# EAGLE design RH023.2 (EAGLE 7.1.0)
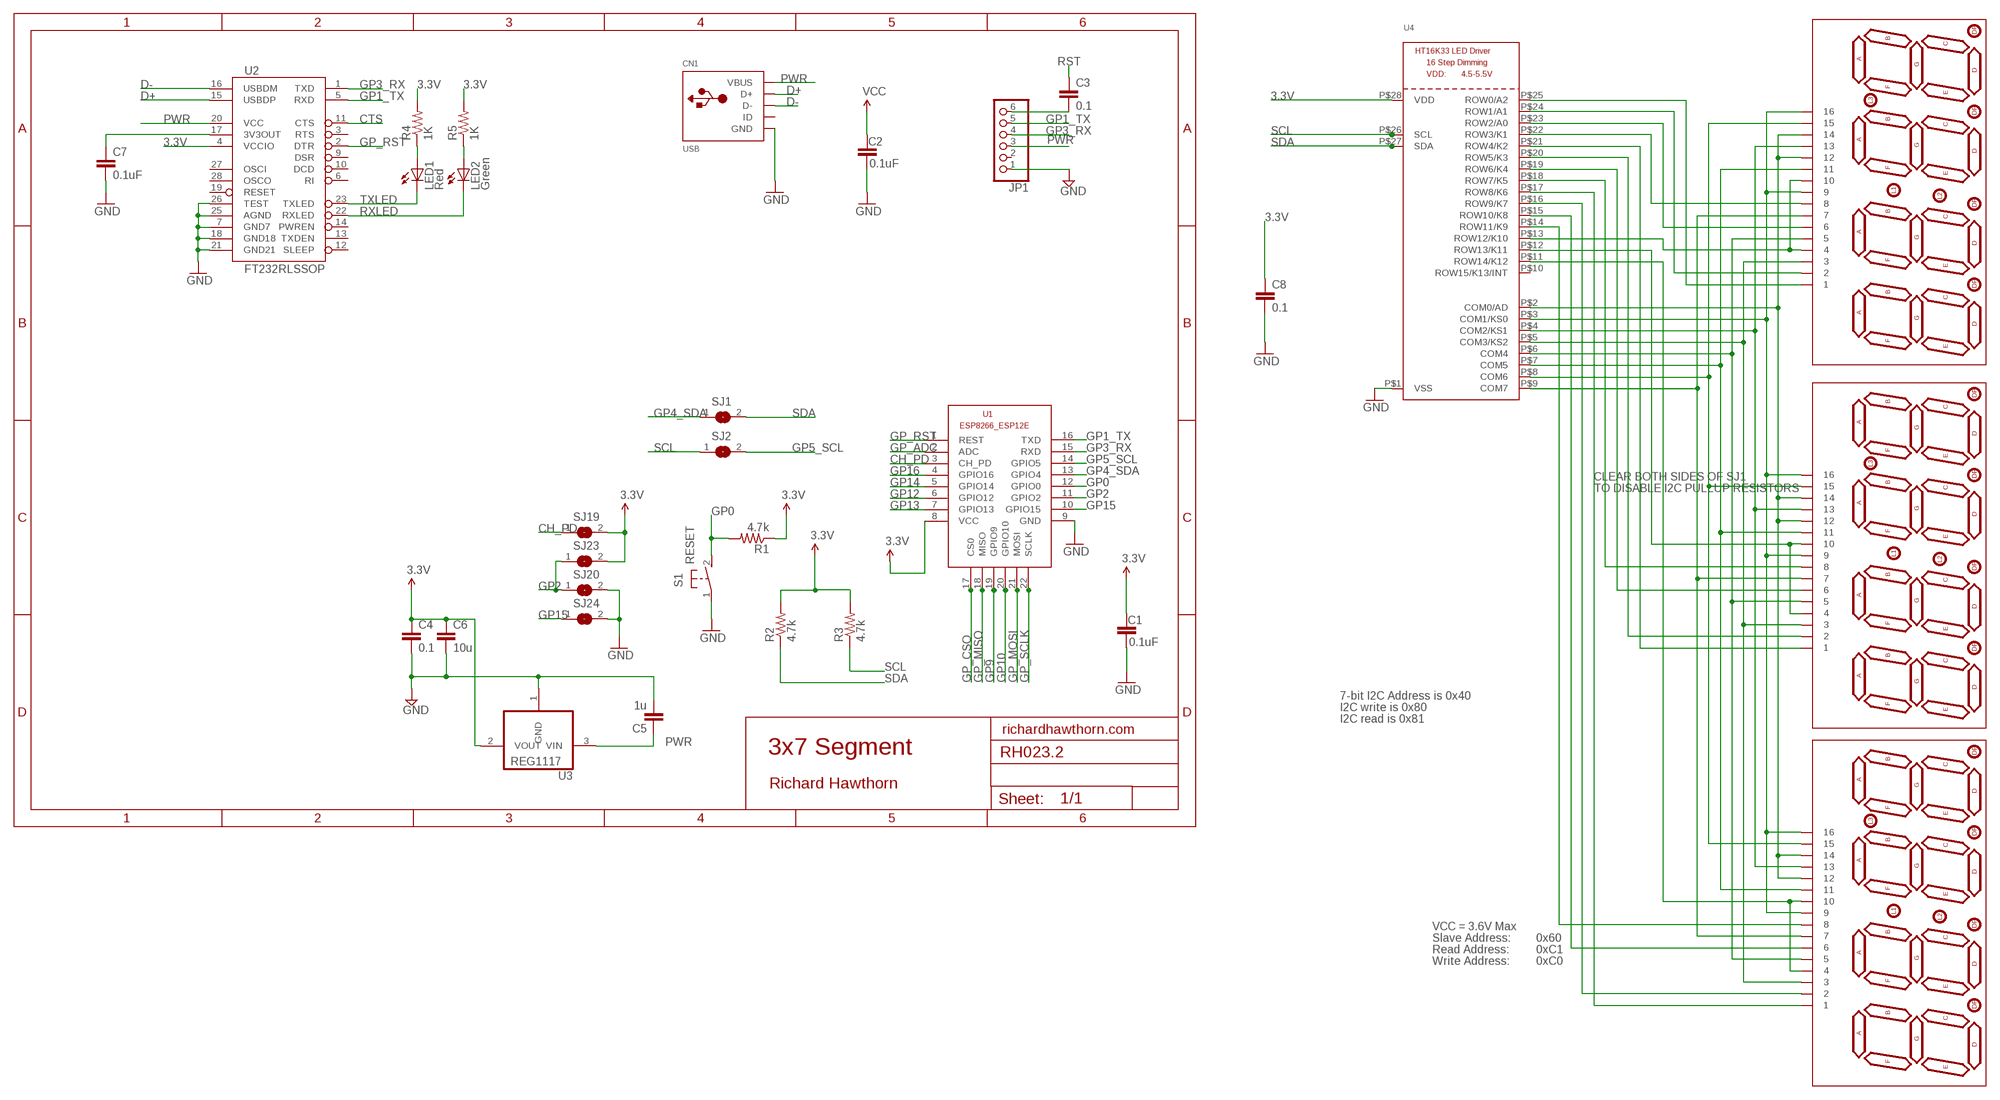
[diagram p0: schematic, sheet 1]

## Parts
C1  0.1uF  0.1UF-25V(+80/-20%)(0603)  [0603-CAP]
C2  0.1uF  0.1UF-25V(+80/-20%)(0603)  [0603-CAP]
C3  0.1  CAP0603-CAP  [0603-CAP]
C4  0.1  CAP0603-CAP  [0603-CAP]
C5  1u  CAP0603-CAP  [0603-CAP]
C6  10u  CAP0805-CAP  [0805-CAP]
C7  0.1uF  CAP0402-CAP  [0402-CAP]
C8  0.1  CAP0603-CAP  [0603-CAP]
CN1  USB  USBMINIB  [USB-MINIB]
JP1  PINHD-1X6  [1X06]
LED1  Red  LED0603  [LED-0603]
LED2  Green  LED0603  [LED-0603]
LED3  7SEG-4DIGIT  [SPARKFUN_7-SEGMENT-4DIGIT]
LED4  7SEG-4DIGIT  [SPARKFUN_7-SEGMENT-4DIGIT]
LED5  7SEG-4DIGIT  [SPARKFUN_7-SEGMENT-4DIGIT]
R1  4.7k  RESISTOR0805-RES  [0805]
R2  4.7k  RESISTOR0805-RES  [0805]
R3  4.7k  RESISTOR0805-RES  [0805]
R4  1K  RESISTOR0402-RES  [0402-RES]
R5  1K  RESISTOR0402-RES  [0402-RES]
S1  RESET  DTSM-3  [DTSM-3]
SJ1  SJ  [SJ]
SJ2  SJ  [SJ]
SJ19  SJ  [SJ]
SJ20  SJ  [SJ]
SJ23  SJ  [SJ]
SJ24  SJ  [SJ]
U1  ESP8266-12EESP8266-ESP12E  [ESP8266-ESP12E]
U2  FT232RLSSOP  [SSOP28DB]
U3  REG1117  [SOT223]
U4  HT16K33_SOP28  [SOP28_300MIL]

## Nets
3.3V: C1.1 C2.1 C4.1 C6.1 C8.1 R1.1 R2.2 R3.2 R4.2 R5.2 SJ19.2 SJ23.2 U1.8(VCC) U2.4(VCCIO) U3.2(VOUT) U4.P$28(VDD) ; supply symbol labelled VCC
3.3VOUT: C7.1 U2.17(3V3OUT)
CH_PD: SJ19.1 U1.3(CH_PD)
CTS: U2.11(CTS)
D+: CN1.D+ U2.15(USBDP)
D-: CN1.D- U2.16(USBDM)
GND [power]: C1.2 C2.2 C4.2 C5.2 C6.2 C7.2 C8.2 CN1.GND JP1.1 S1.1 SJ20.2 SJ24.2 U1.9(GND) U2.7(GND7) U2.18(GND18) U2.21(GND21) U2.25(AGND) U2.26(TEST) U3.1(GND) U4.P$1(VSS)
GP0: R1.2 S1.2 U1.12(GPIO0)
GP1_TX: JP1.5 U1.16(TXD) U2.5(RXD)
GP2: SJ20.1 SJ23.1 U1.11(GPIO2)
GP3_RX: JP1.4 U1.15(RXD) U2.1(TXD)
GP4_SDA: SJ1.1 U1.13(GPIO4)
GP5_SCL: SJ2.2 U1.14(GPIO5)
GP9: U1.19(GPIO9)
GP10: U1.20(GPIO10)
GP12: U1.6(GPIO12)
GP13: U1.7(GPIO13)
GP14: U1.5(GPIO14)
GP15: SJ24.1 U1.10(GPIO15)
GP16: U1.4(GPIO16)
GP_ADC: U1.2(ADC)
GP_CSO: U1.17(CS0)
GP_MISO: U1.18(MISO)
GP_MOSI: U1.21(MOSI)
GP_RST: U1.1(REST) U2.2(DTR)
GP_SCLK: U1.22(SCLK)
N$1: LED3.12 LED3.14 LED4.12 LED4.14 LED5.12 LED5.14 U4.P$2(COM0/AD)
N$2: LED1.A R4.1
N$3: LED2.A R5.1
N$4: LED3.9 LED3.16 LED4.9 LED4.16 LED5.9 LED5.16 U4.P$3(COM1/KS0)
N$5: LED3.13 LED4.13 LED5.13 U4.P$4(COM2/KS1)
N$6: LED3.3 LED4.3 LED5.3 U4.P$5(COM3/KS2)
N$7: LED3.5 LED4.5 LED5.5 U4.P$6(COM4)
N$8: LED3.11 LED4.11 LED5.11 U4.P$7(COM5)
N$9: LED3.15 LED4.15 LED5.15 U4.P$8(COM6)
N$10: LED3.7 LED4.7 LED5.7 U4.P$9(COM7)
N$11: LED3.1 U4.P$25(ROW0/A2)
N$12: LED3.2 U4.P$24(ROW1/A1)
N$13: LED3.6 U4.P$23(ROW2/A0)
N$14: LED3.8 U4.P$22(ROW3/K1)
N$15: LED4.1 U4.P$21(ROW4/K2)
N$16: LED4.2 U4.P$20(ROW5/K3)
N$17: LED4.6 U4.P$19(ROW6/K4)
N$18: LED4.8 U4.P$18(ROW7/K5)
N$19: LED5.1 U4.P$17(ROW8/K6)
N$20: C3.2 JP1.6
N$21: LED5.2 U4.P$16(ROW9/K7)
N$22: LED5.6 U4.P$15(ROW10/K8)
N$23: LED5.8 U4.P$14(ROW11/K9)
N$24: LED3.4 LED3.10 U4.P$13(ROW12/K10)
N$25: LED4.4 LED4.10 U4.P$12(ROW13/K11)
N$26: LED5.4 LED5.10 U4.P$11(ROW14/K12)
PWR [power]: C5.1 CN1.VBUS JP1.3 U2.20(VCC) U3.3(VIN)
RST: C3.1
RXLED: LED2.C U2.22(RXLED)
SCL: R3.1 SJ2.1 U4.P$26(SCL)
SDA: R2.1 SJ1.2 U4.P$27(SDA)
TXLED: LED1.C U2.23(TXLED)
Unconnected: CN1.ID JP1.2 U2.3(RTS) U2.6(RI) U2.9(DSR) U2.10(DCD) U2.12(SLEEP) U2.13(TXDEN) U2.14(PWREN) U2.19(RESET) U2.27(OSCI) U2.28(OSCO) U4.P$10(ROW15/K13/INT)

## Notes on the sheet
- CLEAR BOTH SIDES OF SJ1
- TO DISABLE I2C PULLUP RESISTORS
- 7-bit I2C Address is 0x40
- I2C write is 0x80
- I2C read is 0x81
- richardhawthorn.com
- 3x7 Segment
- Richard Hawthorn
- VCC = 3.6V Max
- Slave Address: | 0x60
- Read Address: | 0xC1
- Write Address: | 0xC0

## Library data of the parts
C1 C2 = SparkFun-Capacitors:0.1UF-25V(+80/-20%)(0603): Ceramic Standard decoupling cap CAP-00810; PROD_ID: CAP-00810
C3-C6 C8 = LowPowerLab:CAP: Capacitor Standard 0603 ceramic capacitor, and 0.1" leaded capacitor.
C7 = SparkFun:CAP: Capacitor Standard 0603 ceramic capacitor, and 0.1" leaded capacitor.
CN1 = LowPowerLab:USB: USB Connectors USBMINIB - Surface Mount Female Mini-B USB Connector 4UConnector: 06564 By microbuilder.eu Thru-hole RA Female Mini-B USB Connector 4UConnector: 18732 By ladyada.net
JP1 = Richards:PINHD-1X6: PIN HEADER
LED1 LED2 = SparkFun:LED: LEDs Standard schematic elements and footprints for 5mm, 3mm, 1206, and 0603 sized LEDs. 5mm - Spark Fun Electronics SKU : COM-00529 (and others)
LED3-LED5 = sparkfun-4digit-sseg:7SEG-4DIGIT
R1-R5 = SparkFun:RESISTOR: Resistor Basic schematic elements and footprints for 0603, 1206, and PTH resistors.
S1 = switch-tact:DTSM-3
SJ1 SJ2 SJ19 SJ20 SJ23 SJ24 = jumper:SJ: SMD solder JUMPER
U1 = ESP8266-ESP12E:ESP8266-12E: ESP8266-12E with additional I/O and GPIO04/05 corrected The author cannot warrant that this library is free from error or will meet your specific requirements. Created by PuceBaboon.com. Komagane, Nagano, JAPAN
U2 = SparkFun:FT232RL: USB UART FT232RL 4th Generation USB UART (USB <-> Serial) Controller. Spark Fun Electronics SKU : COM-00650
U3 = burr-brown:REG1117: 800mA and 1A Low Dropout (LDO) Positive Regulator 1.8V, 2.5V, 2.85V, 3.3V, 5V, and Adj; MPN: REG1117; OC_FARNELL: 1097566; OC_NEWARK: 14P6981
U4 = microbuilder:HT16K33_SOP28

## Net classes
1 power: width 0.381 mm, clearance 0.254 mm

## Board
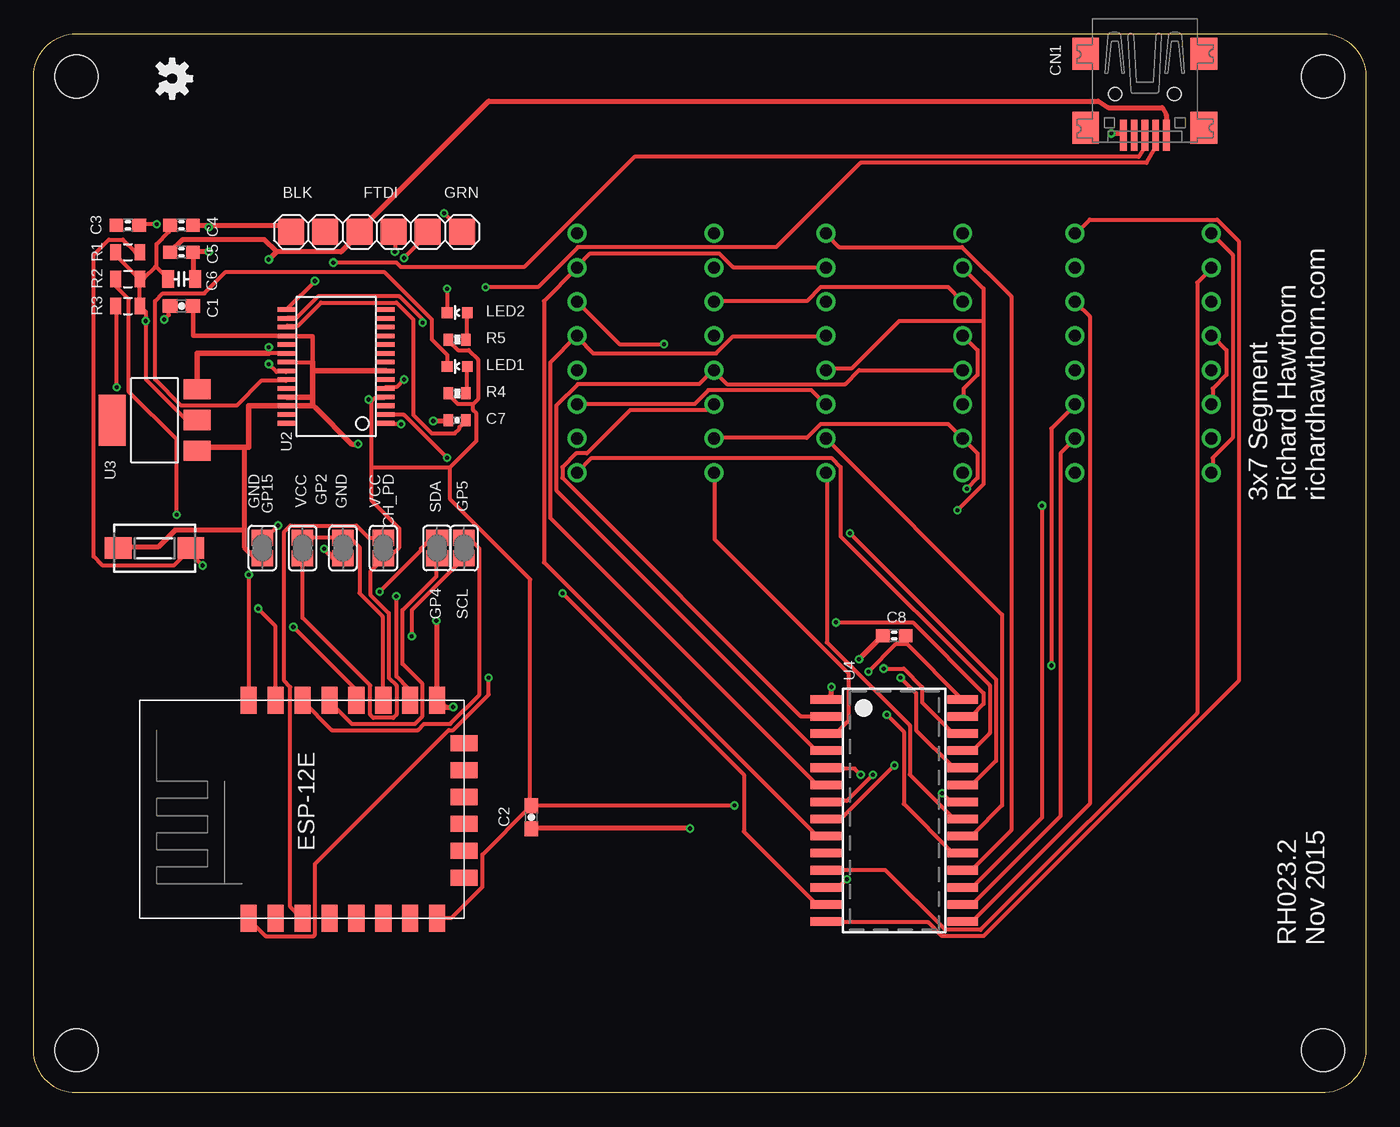
[diagram p1: board, top side]
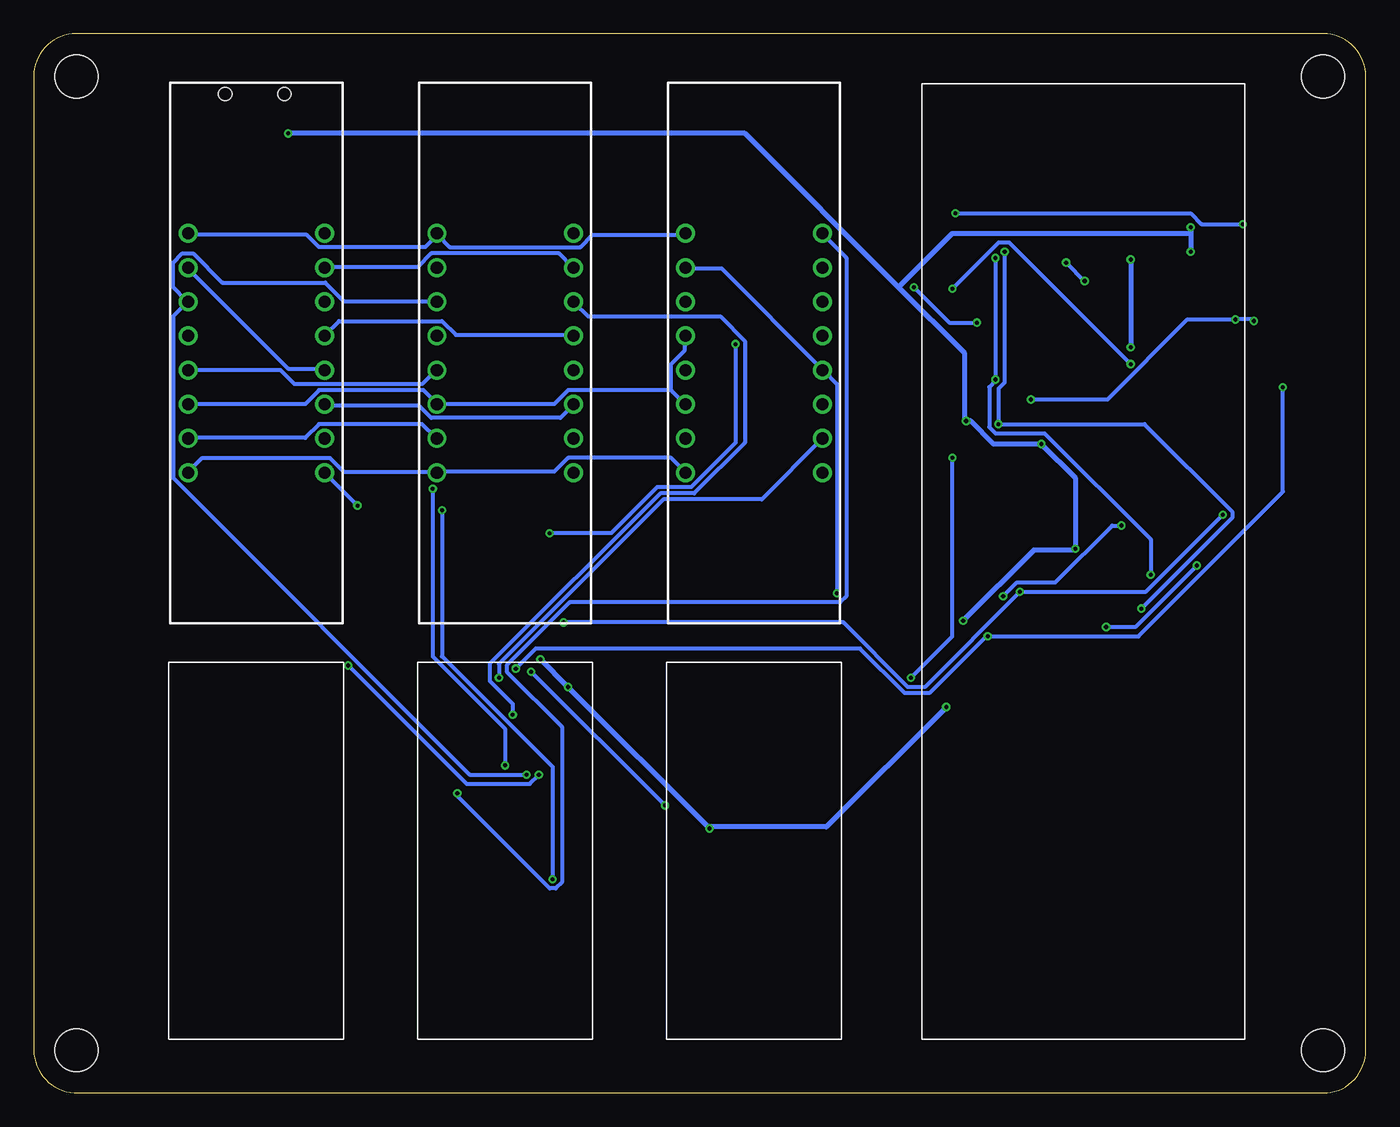
[diagram p2: board, bottom side, seen from below]

Size 99.06 x 78.74 mm. Coordinates in mm from the lower left corner, seen from the top.
Outline: 0,3.17 0,75.56 arc-90 3.17,78.74 95.89,78.74 arc-90 99.06,75.56 99.06,3.17 arc-90 95.76,0 3.17,0 arc-90 0,3.17
Copper layers (1*16): Top 0.035mm / dielectric 1.5mm / Bottom 0.035mm
Design rules "ITEADstudio_DRC *": minimum track width 12mil, minimum drill 12mil, track to track 6mil, track to pad 6mil, pad to pad 6mil, via to via 6mil, smd to smd 0mil, copper to edge 10mil, drill to drill 10mil, minimum pad ring 10mil, minimum via ring 6mil, stop-mask expansion 2mil, vias tented up to drill 100mil, thermal gap 15mil
Holes 3.2 mm at 3.17,3.17 95.89,3.17 3.17,75.56 95.89,75.56
tRestrict: area 0,0 to 15.5,33.5
bRestrict: area 0,0 to 15.5,33.5

### Footprints (pad centres in the part's own frame; a part is rotated, then mirrored left to right if it is on the bottom)
0603-CAP = smd 1.1 x 1: 1 -0.85,0; 2 0.85,0
0603-CAP' = smd 1.016 x 0.965: 1 -0.85,0; 2 0.85,0
0805-CAP = smd 0.902 x 1.3: 1 -1,0; 2 1,0
0402-CAP = smd 0.7 x 0.9: 1 -0.65,0; 2 0.65,0
USB-MINIB = smd 0.5 x 2.308: D+ 0,4.064; D- -0.8,4.064; GND 1.6,4.064; ID 0.8,4.064; VBUS -1.6,4.064 | smd 2 x 2.4: GND1 -4.4,-2; GND2 -4.4,3.5; GND3 4.4,3.5; GND4 4.4,-2 | hole 1: -2.2,1; 2.2,1
1X06 = smd 1.93 x 1.93: 1 -6.35,0; 2 -3.81,0; 3 -1.27,0; 4 1.27,0; 5 3.81,0; 6 6.35,0
LED-0603 = smd 0.8 x 0.8: A 0,-0.75; C 0,0.75
SPARKFUN_7-SEGMENT-4DIGIT = drill 0.9: 1 -8.89,-5.08; 2 -6.35,-5.08; 3 -3.81,-5.08; 4 -1.27,-5.08; 5 1.27,-5.08; 6 3.81,-5.08; 7 6.35,-5.08; 8 8.89,-5.08; 9 8.89,5.08; 10 6.35,5.08; 11 3.81,5.08; 12 1.27,5.08; 13 -1.27,5.08; 14 -3.81,5.08; 15 -6.35,5.08; 16 -8.89,5.08
0805 = smd 0.8 x 1.2: 1 -0.9,0; 2 0.9,0
0402-RES = smd 0.7 x 0.9: 1 -0.65,0; 2 0.65,0
DTSM-3 = smd 2 x 1.6: 1 -2.7,0; 2 2.7,0
SJ = smd 1.168 x 1.6: 1 -0.762,0; 2 0.762,0
ESP8266-ESP12E = smd 2 x 1.2: 1 0,16; 2 0,14; 3 0,12; 4 0,10; 5 0,8; 6 0,6; 7 0,4; 8 0,2; 9 16.2,2; 10 16.2,4; 11 16.2,6; 12 16.2,8; 13 16.2,10; 14 16.2,12; 15 16.2,14; 16 16.2,16 | smd 1.2 x 2: 17 11,0; 18 3,0; 19 5,0; 20 13,0; 21 7,0; 22 9,0
SSOP28DB = smd 0.348 x 1.397: 1 -4.225,-3.656; 2 -3.575,-3.656; 3 -2.925,-3.656; 4 -2.275,-3.656; 5 -1.625,-3.656; 6 -0.975,-3.656; 7 -0.325,-3.656; 8 0.325,-3.656; 9 0.975,-3.656; 10 1.625,-3.656; 11 2.275,-3.656; 12 2.925,-3.656; 13 3.575,-3.656; 14 4.225,-3.656; 15 4.225,3.656; 16 3.575,3.656; 17 2.925,3.656; 18 2.275,3.656; 19 1.625,3.656; 20 0.975,3.656; 21 0.325,3.656; 22 -0.325,3.656; 23 -0.975,3.656; 24 -1.625,3.656; 25 -2.275,3.656; 26 -2.925,3.656; 27 -3.575,3.656; 28 -4.225,3.656
SOT223 = smd 1.499 x 2.007: 1 -2.261,-3.15; 2 0.025,-3.15; 3 2.311,-3.15 | smd 3.81 x 2.007: 4 0,3.15
SOP28_300MIL = smd 0.635 x 2.286: P$1 -8.255,-5.08; P$2 -6.985,-5.08; P$3 -5.715,-5.08; P$4 -4.445,-5.08; P$5 -3.175,-5.08; P$6 -1.905,-5.08; P$7 -0.635,-5.08; P$8 0.635,-5.08; P$9 1.905,-5.08; P$10 3.175,-5.08; P$11 4.445,-5.08; P$12 5.715,-5.08; P$13 6.985,-5.08; P$14 8.255,-5.08; P$15 8.255,5.08; P$16 6.985,5.08; P$17 5.715,5.08; P$18 4.445,5.08; P$19 3.175,5.08; P$20 1.905,5.08; P$21 0.635,5.08; P$22 -0.635,5.08; P$23 -1.905,5.08; P$24 -3.175,5.08; P$25 -4.445,5.08; P$26 -5.715,5.08; P$27 -6.985,5.08; P$28 -8.255,5.08

### Placement (x,y rotation side)
C1  11,58.5 0 top
C2  37,20.5 270 top
C3  0.1  [0603-CAP']  7,64.5 0 top
C4  0.1  [0603-CAP']  11,64.5 0 top
C5  1u  [0603-CAP']  11,62.5 0 top
C6  11,60.5 0 top
C7  31.5,50 180 top
C8  0.1  [0603-CAP']  64,34 180 top
CN1  82.62,75.25 180 top
JP1  25.5,64 0 top
LED1  31.5,54 90 top
LED2  31.5,58 90 top
LED3  45.5,55 90 bottom
LED4  64,55 90 bottom
LED5  82.5,55 90 bottom
R1  7,62.5 0 top
R2  7,60.5 0 top
R3  7,58.5 0 top
R4  31.5,52 180 top
R5  31.5,56 180 top
S1  9,40.5 0 top
SJ1  30,40.5 90 top
SJ2  32,40.5 90 top
SJ19  26,40.5 270 top
SJ20  23,40.5 270 top
SJ23  20,40.5 270 top
SJ24  17,40.5 270 top
U1  32,13 90 top
U2  22.5,54 90 top
U3  9,50 90 top
U4  64,21 270 top
U$3  [OSHW-LOGO-S]  10.3,75.4 270 top

### Tracks (layer width: path | path; a pad name or v marks a point on that pad's centre or on a via)
3.3V  (via drill 0.3)
  Top 0.305: 9.14,61.38 9.14,63.09 10.06,64.01 10.06,64.47 C4.1 | 9.14,61.38 9.94,60.58 C6.1 | R2.2 8,60.58 8.23,60.58 9.03,61.38 9.14,61.38 | R1.1 6.17,62.41 6.17,62.18 7.77,60.58 R2.2 | v9.72,57.49 10.06,57.84 10.06,58.41 C1.1 | U3.2 12.12,50.06 11.32,50.06 8.34,53.03 v8.34,57.38 8.34,58.06 8,58.41 R3.2 7.89,58.64 7.89,60.35 R2.2 | 32.69,51.21 31.55,51.21 30.86,51.89 R4.2 | 32.69,51.21 33.03,51.55 33.03,54.52 32.35,55.21 31.55,55.21 30.86,55.89 R5.2 | 25.15,51.44 25.38,51.66 26.06,51.66 U2.4 | 25.15,46.52 25.15,44.01 27.2,41.95 27.2,40.58 26.4,39.78 26.06,39.78 SJ19.2 25.95,39.66 25.03,38.75 25.03,37.03 26.4,35.66 26.4,30.86 26.98,30.29 26.98,28.12 26.75,27.89 25.26,27.89 25.03,28.12 25.03,30.29 20,35.32 20,39.66 SJ23.2 | 25.15,46.52 25.15,51.44 | 32.69,51.21 32.69,50.75 32.92,50.52 32.92,48.46 30.98,46.52 | 25.15,46.52 30.98,46.52 | v24.92,51.55 25.03,51.44 25.15,51.44 | 64.92,33.38 64.92,33.95 C8.1 | 64.92,33.38 69.04,29.26 U4.P$28 | C2.1 36.92,21.26 33.38,17.72 33.38,15.32 31.09,13.03 30.06,13.03 U1.8 | 64.92,33.38 64.12,33.38 v62.06,31.32 | v52.12,21.37 37.15,21.37 C2.1 | 30.98,46.52 30.98,44.12 36.92,38.18 36.92,21.49 C2.1
  Bottom 0.305: v8.34,57.38 8.46,57.49 v9.72,57.49 13.26,57.49 19.2,51.55 v24.92,51.55 | v52.12,21.37 v62.06,31.32
3.3VOUT
  Top 0.305: C7.1 32.12,49.95 31.66,49.49 31.66,49.38 31.32,49.03 29.6,49.03 28.23,50.41 28.23,57.49 26.98,58.75 21.37,58.75 19.66,57.04 18.86,57.04 U2.17
CH_PD
  Top 0.305: SJ19.1 25.95,41.26 24.92,41.26 24,42.18 19.09,42.18 18.63,41.72 18.63,30.63 19.09,30.18 19.09,13.83 19.89,13.03 U1.3
D+  (via drill 0.3)
  Top 0.305: v20.92,60.35 18.86,58.29 U2.15 | v22.29,61.72 26.98,61.72 27.32,61.38 36.46,61.38 44.67,69.59 82.16,69.59 82.62,70.29 82.62,71.32 CN1.D+
  Bottom 0.305: v22.29,61.72 v20.92,60.35
D-  (via drill 0.3)
  Top 0.305: v28.92,57.26 28.92,57.49 27.2,59.21 21.14,59.21 19.55,57.61 18.86,57.61 U2.16 | v33.6,59.89 37.49,59.89 40.46,62.87 55.21,62.87 61.48,69.13 82.75,69.13 83.42,70.29 83.42,71.32 CN1.D-
  Bottom 0.305: v28.92,57.26 30.98,57.26 v33.6,59.89
GND  (via drill 0.3)
  Top 0.305: U2.21 20.75,54.33
  Top 0.35: 20.75,54.33 20.75,56.25 18.84,56.25 U2.18 11.85,56.27 C1.2
  Top 0.381: v61.38,32.23 63.09,33.95 C8.2 | v59.32,30.18 59.32,29.6 58.98,29.26 U4.P$1 | v48.81,19.66 37.03,19.66 C2.2 | C6.2 11.89,60.58 11.89,62.41 C5.2 12,62.52 v13.03,62.52 | 13.03,64.47 18.63,64.47 19.09,64.01 JP1.1 | 13.03,64.47 11.89,64.47 C4.2 | v13.03,64.35 13.03,64.47 | v29.72,49.95 30.75,49.95 C7.2 | v24.12,48.23 23.66,48.23 20.92,50.98 20.75,51.08 | 15.66,48 15.66,41.83 | 15.66,41.83 15.66,40.58 16.46,39.78 16.92,39.78 SJ24.2 | v21.6,40.46 22.29,39.78 22.97,39.78 SJ20.2 | 15.66,41.83 10.52,41.83 9.26,40.58 6.4,40.58 S1.1 | v29.95,35.09 29.95,29.26 U1.9 30.18,29.15 30.63,28.69 v31.2,28.69 | v80.12,71.32 81.02,71.32 CN1.GND
  Top 0.406: U3.1 12.15,48 15.66,48 16,48 16,51.08 U2.26 20.75,51.08 20.75,51.73 | 20.75,51.73 20.75,53.67 | 20.75,53.67 20.75,54.33 | U2.25 20.75,51.73 | U2.7 20.75,53.67
  Bottom 0.381: v61.38,32.23 v59.32,30.18 v48.81,19.66 48.69,19.77 40.12,19.77 v31.2,28.69 | v13.03,64.35 13.03,63.89 | 13.03,63.89 v13.03,62.52 | v29.95,35.09 24.69,40.35 21.72,40.35 v21.6,40.46 21.6,45.72 v24.12,48.23 27.66,48.23 29.38,49.95 v29.72,49.95 29.83,50.06 29.83,54.98 34.75,59.89 | v80.12,71.32 46.18,71.32 34.75,59.89 | 13.03,63.89 30.75,63.89 34.75,59.89
GP0  (via drill 0.3)
  Top 0.305: R1.2 7.89,62.52 7.54,62.52 6.63,63.44 5.6,63.44 4.46,62.29 4.46,39.89 5.14,39.2 10.4,39.2 11.66,40.46 S1.2 11.54,40.23 v12.57,39.2 | v19.32,34.63 23.89,30.06 23.89,29.26 U1.12
  Bottom 0.305: v19.32,34.63 17.14,34.63 v12.57,39.2
GP1_TX  (via drill 0.3)
  Top 0.305: v27.55,53.03 26.98,52.46 26.18,52.46 U2.5 | v27.55,62.06 29.38,63.89 JP1.5 | v16,38.52 16,29.26 U1.16
  Bottom 0.305: v27.55,62.06 v27.55,53.03 27.55,52.92 28,52.46 28,49.49 27.55,49.03 23.89,49.03 16,41.15 v16,38.52
GP2
  Top 0.305: SJ23.1 22.97,41.26 SJ20.1 23.09,41.15 23.66,41.15 24.23,40.58 24.23,37.15 25.95,35.43 25.95,29.26 U1.11
GP3_RX  (via drill 0.3)
  Top 0.305: v27.32,49.72 26.18,49.72 U2.1 | v26.86,62.52 26.86,63.89 JP1.4 | v16.69,36.01 17.95,34.75 17.95,29.26 U1.15
  Bottom 0.305: v26.86,62.52 26.86,52.81 27.32,52.35 v27.32,49.72 16.46,49.72 9.94,43.2 9.94,42.75 v16.69,36.01
GP4_SDA
  Top 0.305: SJ1.1 29.95,39.66 29.95,38.41 27.43,35.89 27.43,31.89 28.92,30.4 28.92,28 28.35,27.43 23.66,27.43 21.95,29.15 U1.13
GP5_SCL
  Top 0.305: SJ2.2 32,41.15 32.46,41.15 33.15,40.46 33.15,29.6 30.98,27.43 29.03,27.43 28.57,26.98 22.17,26.98 20,29.15 U1.14
GP15  (via drill 0.3)
  Top 0.305: v18.17,42.18 17.26,41.26 17.03,41.26 SJ24.1 | v26.98,36.92 26.98,30.98 27.89,30.06 27.89,29.26 U1.10
  Bottom 0.305: v18.17,42.18 18.86,42.18 23.09,37.95 25.95,37.95 v26.98,36.92
GP_RST  (via drill 0.3)
  Top 0.305: v30.75,47.21 27.55,50.41 26.18,50.41 U2.2 | v33.83,30.86 33.83,29.6 31.2,26.98 30.86,26.98 20.92,17.03 20.92,11.77 20.8,11.66 17.26,11.66 16,12.92 U1.1
  Bottom 0.305: v30.75,47.21 30.75,33.95 v33.83,30.86
N$1
  Top 0.305: LED5.14 87.67,51.21 87.67,52.35 88.7,53.38 88.7,55.21 87.67,56.24 LED5.12 | LED4.14 69.15,51.21 69.15,52.35 70.18,53.38 70.18,55.21 69.15,56.24 LED4.12 | U4.P$2 58.86,28 57.04,28 39.32,45.72 39.32,46.52 40.35,47.55 41.15,47.55 44.35,50.75 50.18,50.75 50.52,51.09 LED3.14
  Bottom 0.305: 51.66,52.23 51.66,54.18 50.63,55.21 50.63,56.24 LED3.12 | 51.66,52.23 50.63,51.21 LED3.14 | 51.66,52.23 59.32,52.23 60.35,51.21 69.04,51.21 LED4.14 69.15,51.32 70.07,52.23 77.84,52.23 78.87,51.21 87.55,51.21 LED5.14
N$2
  Top 0.305: LED1.A 32.23,53.95 32.23,52.01 R4.1
N$3
  Top 0.305: LED2.A 32.23,57.95 32.23,56.01 R5.1
N$4
  Top 0.305: U4.P$3 58.98,26.75 59.66,26.75 60.58,27.66 60.58,31.2 50.63,41.15 50.63,46.06 LED3.16 | LED5.16 87.67,46.18 87.67,47.21 89.15,48.69 89.15,62.29 87.67,63.78 LED5.9
  Bottom 0.305: LED3.16 50.63,46.18 51.66,47.21 59.32,47.21 60.35,46.18 69.04,46.18 LED4.16 69.15,46.18 76.01,46.18 77.04,47.21 86.53,47.21 87.55,46.18 LED5.16 | LED3.9 50.63,63.78 57.49,63.78 58.41,62.87 68.12,62.87 69.04,63.78 LED4.9 69.15,63.66 69.95,62.87 77.84,62.87 78.75,63.78 87.55,63.78 LED5.9
N$5
  Top 0.305: U4.P$4 58.86,25.49 58.18,25.49 38.86,44.81 38.86,51.09 40.46,52.69 49.49,52.69 50.52,53.72 LED3.13 50.63,53.61 51.55,52.69 60.35,52.69 61.38,53.72 69.04,53.72 LED4.13
  Bottom 0.305: LED5.13 87.55,53.72 80.7,53.72 79.67,52.69 70.18,52.69 69.15,53.72 LED4.13
N$6  (via drill 0.3)
  Top 0.305: LED3.3 40.46,51.21 49.15,51.21 50.18,52.23 57.84,52.23 58.86,51.21 LED4.3 | v61.49,23.66 61.04,24.12 58.98,24.12 U4.P$5 | v75.67,31.77 75.67,49.38 77.38,51.09 LED5.3
  Bottom 0.305: LED5.3 77.38,51.09 70.41,51.09 69.49,50.18 59.89,50.18 58.98,51.09 LED4.3 | v61.49,23.66 62.18,22.97 66.86,22.97 v75.67,31.77
N$7
  Top 0.305: U4.P$6 58.86,22.97 58.18,22.97 38.41,42.75 38.41,54.29 40.35,56.24 LED3.5 40.46,56.12 41.6,54.98 50.75,54.98 52.01,56.24 58.86,56.24 LED4.5
  Bottom 0.305: LED4.5 58.98,56.35 67.67,56.35 68.69,57.38 76.35,57.38 77.38,56.35 LED5.5
N$8  (via drill 0.3)
  Top 0.305: LED3.11 50.63,58.86 57.49,58.86 58.52,59.89 68.01,59.89 69.04,58.86 LED4.11 | v62.41,23.66 60.47,21.72 58.98,21.72 U4.P$7
  Bottom 0.305: v62.41,23.66 66.64,23.66 88.7,45.72 88.7,57.72 87.67,58.75 LED5.11 87.67,58.86 88.7,59.89 88.7,61.72 88.01,62.41 87.21,62.41 85.04,60.24 77.38,60.24 76.01,58.86 69.15,58.86 LED4.11
N$9  (via drill 0.3)
  Top 0.305: v64.01,24.35 60.12,20.46 58.98,20.46 U4.P$8 | v69.38,44.92 70.18,45.72 70.18,47.55 69.15,48.58 LED4.15 69.04,48.69 68.01,49.72 58.52,49.72 57.49,48.69 50.63,48.69 LED3.15
  Bottom 0.305: v64.01,24.35 64.01,27.09 69.38,32.46 v69.38,44.92 | LED5.15 87.55,48.69 78.87,48.69 77.84,49.72 70.18,49.72 69.15,48.69 LED4.15
N$10
  Top 0.305: U4.P$9 58.86,19.2 58.18,19.2 37.95,39.43 37.95,58.86 40.35,61.27 LED3.7 40.46,61.49 41.38,62.41 50.98,62.41 52.01,61.38 58.86,61.38 LED4.7
  Bottom 0.305: LED5.7 77.38,61.38 70.52,61.38 69.49,62.41 60.01,62.41 58.98,61.38 LED4.7
N$11
  Top 0.305: U4.P$25 69.15,25.49 69.84,25.49 71.09,26.75 71.09,30.29 60.01,41.38 60.01,46.52 59.32,47.21 41.49,47.21 40.46,46.18 LED3.1
N$12  (via drill 0.3)
  Top 0.305: v64.47,30.86 65.61,29.72 65.61,26.98 68.35,24.23 69.04,24.23 U4.P$24
  Bottom 0.305: v64.47,30.86 64.47,31.89 52.23,44.12 44.92,44.12 40.46,48.58 LED3.2
N$13  (via drill 0.3)
  Top 0.305: v60.69,41.6 71.55,30.75 71.55,24.69 69.84,22.97 69.15,22.97 U4.P$23 | v46.86,55.66 43.55,55.66 40.46,58.75 LED3.6
  Bottom 0.305: v60.69,41.6 56.12,41.6 52.69,45.03 50.18,45.03 46.86,48.35 v46.86,55.66
N$14  (via drill 0.3)
  Top 0.305: v67.55,22.29 68.12,21.72 69.04,21.72 U4.P$22
  Bottom 0.305: v67.55,22.29 67.55,22.06 60.69,15.2 60.24,15.2 59.78,15.66 59.78,27.2 63.89,31.32 63.89,31.77 59.21,36.46 39.09,36.46 38.63,36.92 38.63,62.06 40.35,63.78 LED3.8
N$15
  Top 0.305: U4.P$21 69.04,20.46 68.35,20.46 65.15,23.66 65.15,27.32 58.98,33.49 58.98,46.06 LED4.1
N$16
  Top 0.305: U4.P$20 69.15,19.2 69.84,19.2 72.01,21.37 72.01,35.55 58.98,48.58 LED4.2
N$17  (via drill 0.3)
  Top 0.305: v63.44,28.12 64.69,26.86 64.69,21.49 68.35,17.83 69.04,17.83 U4.P$19
  Bottom 0.305: v63.44,28.12 63.44,28.92 65.15,30.63 65.15,31.89 52.46,44.58 49.95,44.58 46.18,48.35 46.18,55.89 48.01,57.72 57.84,57.72 58.86,58.75 LED4.6
N$18
  Top 0.305: U4.P$18 69.15,16.57 69.72,16.57 72.69,19.55 72.69,59.21 69.04,62.87 59.89,62.87 58.98,63.78 LED4.8
N$19  (via drill 0.3)
  Top 0.305: v74.98,43.66 74.98,20.46 69.84,15.32 69.15,15.32 U4.P$17
  Bottom 0.305: v74.98,43.66 77.38,46.06 LED5.1
N$20  (via drill 0.3)
  Top 0.305: v9.14,64.58 7.89,64.58 C3.2 | v30.52,65.38 31.89,64.01 JP1.6
  Bottom 0.305: v9.14,64.58 12.23,64.58 13.03,65.38 v30.52,65.38
N$21
  Top 0.305: U4.P$16 69.15,14.06 69.84,14.06 76.35,20.57 76.35,47.55 77.38,48.58 LED5.2
N$22
  Top 0.305: U4.P$15 69.15,12.8 69.84,12.8 78.52,21.49 78.52,57.72 77.5,58.75 LED5.6
N$23
  Top 0.305: U4.P$14 58.98,12.69 66.52,12.69 67.55,11.66 70.64,11.66 89.61,30.63 89.61,63.32 88.01,64.92 78.52,64.92 77.5,63.89 LED5.8
N$24  (via drill 0.3)
  Top 0.305: v39.32,37.15 52.81,23.66 52.81,19.43 58.18,14.06 58.86,14.06 U4.P$13
  Bottom 0.305: v39.32,37.15 39.32,52.69 40.35,53.72 LED3.4 40.46,53.84 47.89,61.27 50.52,61.27 LED3.10
N$25  (via drill 0.3)
  Top 0.305: v60.47,15.89 59.89,15.32 58.98,15.32 U4.P$12 | v68.69,43.32 70.64,45.26 70.64,57.38 | 70.64,57.38 70.64,59.78 69.15,61.27 LED4.10 | 70.64,57.38 64.35,57.38 60.81,53.84 58.98,53.84 LED4.4
  Bottom 0.305: v60.47,15.89 60.47,24.23 68.69,32.46 v68.69,43.32
N$26
  Top 0.305: U4.P$11 58.98,16.57 63.32,16.57 67.78,12.12 70.41,12.12 86.53,28.23 86.53,60.24 87.55,61.27 LED5.10
  Bottom 0.305: LED5.4 77.5,53.84 80.12,53.84 87.55,61.27 LED5.10
PWR  (via drill 0.3)
  Top 0.305: U2.20 17.49,54.98
  Top 0.381: 18.06,62.52 17.14,63.44 11.09,63.44 10.17,62.52 C5.1 | 18.06,62.52 22.86,62.52 24.23,63.89 JP1.3 24.23,64.12 33.83,73.72 79.17,73.72 79.9,73.25 83.92,73.25 84.22,72.69 84.22,71.44 CN1.VBUS | v17.49,55.44 17.49,54.98 | 18.06,62.52 v17.49,61.95
  Top 0.406: 17.49,54.98 12.15,54.98 U3.3
  Bottom 0.381: v17.49,61.95 v17.49,55.44
RXLED  (via drill 0.3)
  Top 0.305: v30.75,59.78 30.75,58.06 LED2.C | v17.49,54.18 18.06,53.61 18.75,53.61 U2.22
  Bottom 0.305: v30.75,59.78 27.32,63.21 26.52,63.21 v17.49,54.18
SCL  (via drill 0.3)
  Top 0.305: v6.17,52.46 6.17,58.41 R3.1 | v28.12,33.95 28.12,35.89 31.89,39.66 SJ2.1 | v63.21,31.55 64.69,31.55 66.06,30.18 66.06,29.03 68.35,26.75 69.04,26.75 U4.P$26
  Bottom 0.305: v6.17,52.46 6.17,44.69 16.92,33.95 v28.12,33.95 28.23,33.95 32.46,29.72 34.29,29.72 37.6,33.03 61.72,33.03 v63.21,31.55
SDA  (via drill 0.3)
  Top 0.305: v10.63,42.98 10.63,48.58 7.09,52.12 7.09,58.98 6.17,59.89 6.17,60.47 R2.1 | v25.72,37.26 28.8,40.35 28.8,40.46 29.49,41.15 29.95,41.15 SJ1.2 | v59.66,34.98 65.38,34.98 70.64,29.72 70.64,28.92 69.72,28 69.15,28 U4.P$27
  Bottom 0.305: v10.63,42.98 16.34,37.26 v25.72,37.26 32.8,30.18 34.06,30.18 38.86,34.98 v59.66,34.98
TXLED
  Top 0.305: LED1.C 30.75,54.06 30.75,54.86 29.6,56.01 29.6,57.49 26.06,61.04 14.29,61.04 12.69,59.44 9.6,59.44 9.03,58.86 9.03,53.03 10.97,51.09 15.09,51.09 16.92,52.92 18.75,52.92 U2.23

### Text on the board
tNames: BLK | FTDI | GRN | GND | GP15 | VCC | GP2 | GND | VCC | CH_PD | SDA | GP5 | 3x7 Segment / Richard Hawthorn / richardhawthorn.com | GP4 | SCL | RH023.2 / Nov 2015
tDocu: REG